# EAGLE design cc2652_zr_Type-A (EAGLE 9.6.2)
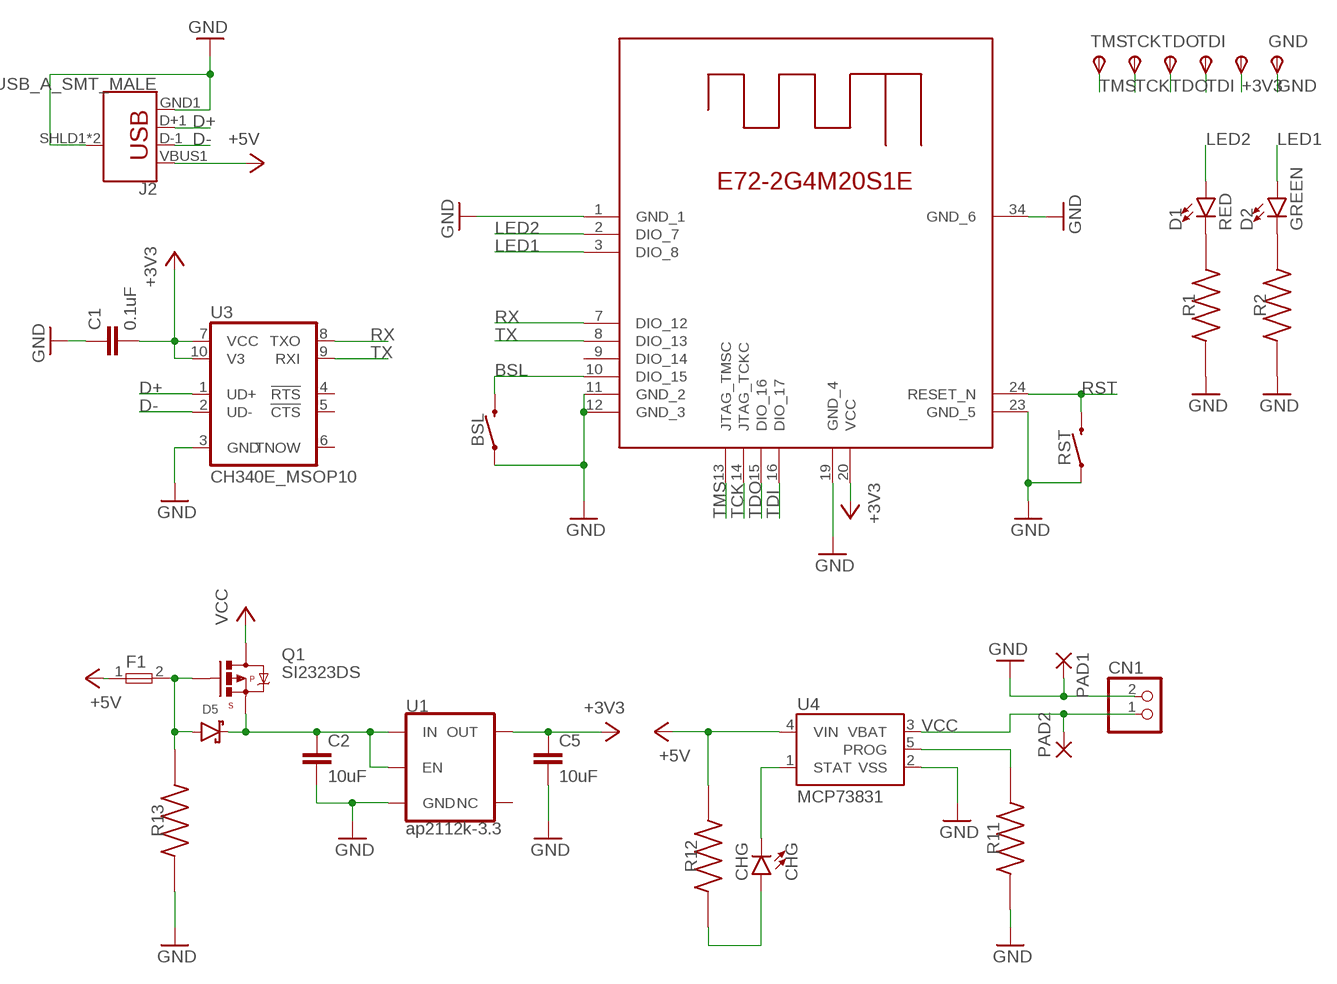
[diagram p0: schematic, sheet 1]

## Parts
+3V3  TPSTP11R  [TP11R]
BSL  MOMENTARY-SWITCH-SPST-SMD-4.6X2.8MM  [TACTILE_SWITCH_SMD_4.6X2.8MM]
C1  0.1uF  0.1UF-0603-25V-(+80/-20%)  [0603]
C2  10uF  10UF-0603-6.3V-20%  [0603]
C5  10uF  10UF-0603-6.3V-20%  [0603]
CHG  CHG  LED-BLUE0603  [LED-0603]
CN1  JST_2PIN-SMT-RA  [JST-PH-2-SMT-RA]
D1  RED  LED-RED0603  [LED-0603]
D2  GREEN  LED-GREEN0603  [LED-0603]
D5  DIODE-SCHOTTKY  [SOD-323]
F1  FEMTOSMDC016F-02  [RESC1608X50N]
GND  TPSTP11R  [TP11R]
J2  USB_A_SMT_MALE  [USB-A-SMT-MALE]
PAD1  WIREPADSMD1,27-254  [SMD1,27-2,54]
PAD2  WIREPADSMD1,27-254  [SMD1,27-2,54]
Q1  SI2323DS  MOSFET-PCHANNEL  [SOT23]
R1  2.2k  RC0402FR-073M6L  [RESC1005X40N]
R2  2.2k  RC0402FR-073M6L  [RESC1005X40N]
R11  2k  RC0402FR-073M6L  [RESC1005X40N]
R12  2.2k  RC0402FR-073M6L  [RESC1005X40N]
R13  10k  RC0402FR-073M6L  [RESC1005X40N]
RST  MOMENTARY-SWITCH-SPST-SMD-4.6X2.8MM  [TACTILE_SWITCH_SMD_4.6X2.8MM]
TCK  TPSTP11R  [TP11R]
TDI  TPSTP11R  [TP11R]
TDO  TPSTP11R  [TP11R]
TMS  TPSTP11R  [TP11R]
U1  ap2112k-3.3  V_REG_AP2112K-3.3V  [SOT23-5]
U3  CH340E_MSOP10  [MSOP10]
U4  MCP73831  [SOT23-5]
U$1  E72-2G4M20S1E  [E72-2G4M20S1E]

## Nets
+3V3: +3V3.TP(PP) C1.2 C5.1 U1.5(OUT) U3.7(VCC) U3.10(V3) U$1.20(VCC)
+5V: F1.1 J2.VBUS1(VBUS) R12.2 U4.4(VIN)
BSL: BSL.3 BSL.4 U$1.10(DIO_15)
D+: J2.D+1(D+) U3.1(UD+)
D-: J2.D-1(D-) U3.2(UD-)
GND: BSL.1 BSL.2 C1.1 C2.2 C5.2 CN1.2 GND.TP(PP) J2.GND1(GND) J2.SHLD1(SHIELD) J2.SHLD2(SHIELD) PAD1.1(P) R1.1 R2.1 R11.1 R13.1 RST.1 RST.2 U1.2(GND) U3.3(GND) U4.2(VSS) U$1.1(GND_1) U$1.11(GND_2) U$1.12(GND_3) U$1.19(GND_4) U$1.23(GND_5) U$1.34(GND_6)
LED1: D2.A U$1.3(DIO_8)
LED2: D1.A U$1.2(DIO_7)
N$1: C2.1 D5.C Q1.2(S) U1.1(IN) U1.3(EN)
N$2: D5.A F1.2 Q1.1(G) R13.2
N$3: D1.C R1.2
N$4: D2.C R2.2
N$8: R11.2 U4.5(PROG)
N$9: CHG.A R12.1
N$11: CHG.C U4.1(STAT)
RST: RST.3 RST.4 U$1.24(RESET_N)
RX: U3.8(TXO) U$1.7(DIO_12)
TCK: TCK.TP(PP) U$1.14(JTAG_TCKC)
TDI: TDI.TP(PP) U$1.16(DIO_17)
TDO: TDO.TP(PP) U$1.15(DIO_16)
TMS: TMS.TP(PP) U$1.13(JTAG_TMSC)
TX: U3.9(RXI) U$1.8(DIO_13)
VCC: CN1.1 PAD2.1(P) Q1.3(D) U4.3(VBAT)
Unconnected: U1.4(NC) U3.4(!RTS) U3.5(!CTS) U3.6(TNOW) U$1.9(DIO_14)

## Library data of the parts
+3V3 GND TCK TDI TDO TMS = testpad:TPS: TEST PIN
BSL RST = SparkFun-Switches:MOMENTARY-SWITCH-SPST: Momentary Switch (Pushbutton) - SPST Normally-open (NO) SPST momentary switches (buttons, pushbuttons). Variants PTH-12MM - 12mm square, through-hole Momentary Pushbutton Switch - 12mm Square <https://www.sparkfun.com/products/9190> (COM-09190) PTH-6.0MM, PTH-6.0MM-KIT - 6.0mm square, through-hole Mini Pushbutton Switch <https://www.sparkfun.com/products/97> (COM-00097) KIT package intended for soldering kit's - only one side of pads' copper is exposed. PTH-RIGHT-ANGLE-KIT - Right-angle, through-hole Right Angle Tactile Button <https://www.sparkfun.com/products/10791> - Used on SparkFun BigTime Watch Kit <https://www.sparkfun.com/products/11734> SMD-12MM - 12mm square, surface-mount Tactile Button - SMD (12mm) <https://www.sparkfun.com/products/12993> (COM-12993) Used on SparkFun PicoBoard <https://www.sparkfun.com/products/11888> SMD-4.5MM - 4.5mm Square Trackball Switch Used on SparkFun Blackberry Trackballer Breakout <https://www.sparkfun.com/products/13169> SMD-4.6MMX2.8MM - 4.60mm x 2.80mm, surface mount Used on SparkFun SAMD21 Mini Breakout <https://www.sparkfun.com/products/13664> SMD-5.2MM, SMD-5.2-REDUNDANT - 5.2mm square, surface-mount Mini Pushbutton Switch - SMD <https://www.sparkfun.com/products/8720> (COM-08720) Used on Arduino Pro Mini <https://www.sparkfun.com/products/11114> REDUNDANT package connects both switch circuits together SMD-6.0X3.5MM - 6.0 x 3.5mm, surface mount Momentary Reset Switch SMD <https://www.sparkfun.com/products/8229> (COM-08229) SMD-6.2MM-TALL - 6.2mm square, surface mount Tactile Button - SMD (6mm) <https://www.sparkfun.com/products/12992> Used on SparkFun Digital Sandbox <https://www.sparkfun.com/products/12651> SMD-RIGHT-ANGLE - Right-angle, surface mount Used on SparkFun Block for Intel® Edison - Arduino <https://www.sparkfun.com/products/13036>; PROD_ID: SWCH-13065
C1 = SparkFun-Capacitors:0.1UF: 0.1µF ceramic capacitors A capacitor is a passive two-terminal electrical component used to store electrical energy temporarily in an electric field.; PROD_ID: CAP-00810
C2 C5 = SparkFun-Capacitors:10UF: 10.0µF ceramic capacitors A capacitor is a passive two-terminal electrical component used to store electrical energy temporarily in an electric field.; PROD_ID: CAP-11015
CHG = SparkFun-LED:LED-BLUE: Blue SMD LED Used in manufacturing of various products at SparkFun Packages: 0603 - SMD 0603 package [Product Link] <http://www.digikey.com/product-detail/en/SMLE12BC7TT86/511-1589-2-ND/1641808> 1206 - SMD1206 package [Product Link] <http://www.digikey.com/product-detail/en/lite-on-inc/LTST-C150TBKT/160-1643-1-ND/573584> SparkFun Products: ESP8266 Thing-Dev Board <https://www.sparkfun.com/products/13711> RedBoard <https://www.sparkfun.com/products/12757>; PROD_ID: DIO-08575; VALUE: BLUE
CN1 = adafruit:JST_2PIN: JST 2-Pin Connectors of various flavors SMT-RA (S2B-PH-SM4) 4UConnector #17311 SMT (B2B-PH-SM4) THM-RA (S2B-PH) THM (B2B-PH)
D1 = SparkFun-LED:LED-RED: Red SMD LED Used in manufacturing of most products at SparkFun Packages: 0603 - SMD 0603 package [Product Link] <http://docs.avagotech.com/docs/AV02-0551EN> 0603 SMART - SMD 0603 SMART package ( more efficient and expensive)[Product Link] <http://www.osram-os.com/Graphics/XPic2/00077099_0.pdf> 1206 - SMD1206 package [Product Link] <https://www.sparkfun.com/datasheets/DevTools/LilyPad/Q150OVS4.pdff> SparkFun Products: Pro Mini 328 -5V <https://www.sparkfun.com/products/821> RedBoard <https://www.sparkfun.com/products/12757> IOIO-OTG <https://www.sparkfun.com/products/13613>; PROD_ID: DIO-00819
D2 = SparkFun-LED:LED-GREEN: Green SMD LED Used in manufacturing of various products at SparkFun Packages: 0603 - SMD 0603 package [Product Link] <http://www.futureelectronics.com/en/technologies/semiconductors/optoelectronics/leds/Pages/9894312-LTST-C190GKT.aspx?CrossPart=HSMG-C190&IM=0> LilyPad 1206 - SMD1206 LilyPad package [Product Link] <http://www.futureelectronics.com/en/Technologies/Product.aspx?ProductID=IN150NGHARVATEKCORPORATION2049943&IM=0> 1206 - SMD1206 package [Product Link] <http://www.futureelectronics.com/en/technologies/semiconductors/optoelectronics/leds/Pages/8315665-LTST-C150KGKT.aspx?IM=0> 1206 Bottom Mount -SMD 1206 Bottom Mount [Product Link] <http://www.digikey.com/product-detail/en/lite-on-inc/LTST-C230KGKT/160-1456-1-ND/386854> SparkFun Products: Pro Mini 328 -5V <https://www.sparkfun.com/products/821> RedBoard <https://www.sparkfun.com/products/12757> MP3 Trigger <https://www.sparkfun.com/products/13720> Makey Makey <https://www.sparkfun.com/products/11076>; PROD_ID: DIO-00821
D5 = pimoroni-passives:DIODE-SCHOTTKY
F1 = fuse_FEMTOSMDC016F-02:FEMTOSMDC016F-02: PTC Resettable Fuse 0.16A(hold) 0.4A(trip) 9VDC 40A 0.5W 0.1s 1Ohm SMD Solder Pad 0603 T/R Check availability <https://pricing.snapeda.com/parts/FEMTOSMDC016F-02/Littelfuse%20Inc./view-part?ref=eda>; AVAILABILITY: In Stock; DESCRIPTION: Polymeric PTC Resettable Fuse 9V 160 mA Ih Surface Mount 0603 (1608 Metric), Concave; MF: Littelfuse Inc.; MP: FEMTOSMDC016F-02; PACKAGE: None; PRICE: None; PURCHASE-URL: https://pricing.snapeda.com/search/part/FEMTOSMDC016F-02/?ref=eda
J2 = SparkFun-Connectors:USB_A: USB-A Connector Male and female variants, as well as PTH and SMT variants SparkFun Products: SparkFun XBee Explorer Dongle <https://www.sparkfun.com/products/11697> PTH Male SparkFun MicroView-USB Programmer <https://www.sparkfun.com/products/12924> SMT Male SparkFun USB Type A Female Breakout <https://www.sparkfun.com/products/12700> SMT Female; PROD_ID: CONN-11499
PAD1 PAD2 = wirepad:WIREPAD: Wire PAD connect wire on PCB
Q1 = pimoroni-passives:MOSFET-PCHANNEL: Generic PMOSFET
R1 R2 R11-R13 = RC0402FR-073M6L:RC0402FR-073M6L: RESISTOR, 0402 0.063W 1% 3M6; Resistance:3.6Mohm; Resistance Tolerance:± 1%; Power Rating:0.063W; Voltage Rating:50V; Series:RC32H; Temperature Coefficient:± 100ppm/°C; Resistor Element Type:Thick Film; Resistor Case Style:0402; No. of Pins:2; SVHC:No SVHC; Case Style:0402; External Length / Height:1mm; Temperature Coeff. +:100ppm/°C; Temperature Coeff. -:100ppm/°C; External Depth:0.35mm; External Width:0.5mm; Operating Temperature Range:-55°C to +155°C; Overload Voltage:100V Check prices <https://pricing.snapeda.com/parts/RC0402FR-073M6L/Yageo/view-part?ref=eda>; AVAILABILITY: Good; DESCRIPTION: RESISTOR, 0402 0.063W 1% 3M6; Resistance:3.6Mohm; Resistance Tolerance:± 1%; Power Rating:0.063W; Voltage Rating:50V; Series:RC32H; Temperature Coefficient:± 100ppm/°C; Resistor Element Type:Thick Film; Resistor Case Style:0402; No. of Pins:2; SVHC:No SVHC; Case Style:0402; External Length / Height:1mm; Temperature Coeff. +:100ppm/°C; Temperature Coeff. -:100ppm/°C; External Depth:0.35mm; External Width:0.5mm; Operating Temperature Range:-55°C to +155°C; Overload Voltage:100V; MF: Yageo; MP: RC0402FR-073M6L; PACKAGE: 1005 Panasonic Electronic Components; PRICE: None; PURCHASE-URL: https://pricing.snapeda.com/search/part/RC0402FR-073M6L/?ref=eda
U1 = SparkFun-IC-Power:V_REG_AP2112: AP2112 - 600mA CMOS LDO Regulator w/ Enable The AP2112 is CMOS process low dropout linear regulator with enable function, the regulator delivers a guaranteed 600mA (min.) continuous load current. Features Output Voltage Accuracy: ±1.5% Output Current: 600mA (Min.) Foldback Short Current Protection: 50mA Enable Function to Turn ON/OFF VOUT Low Dropout Voltage (3.3V): 250mV (Typ.) @IOUT=600mA Excellent Load Regulation: 0.2%/A (Typ.) Excellent Line Regulation: 0.02%/V (Typ.) Low Quiescent Current: 55μA (Typ.) Low Standby Current: 0.01μA (Typ.) Low Output Noise: 50μVRMS PSRR: 100Hz -65dB, 1kHz -65dB OTSD Protection Stable with 1.0μF Flexible Cap: Ceramic, Tantalum and Aluminum Electrolytic Operation Temperature Range: -40°C to 85°C ESD: MM 400V, HBM 4000V; PROD_ID: VREG-12457; VALUE: 3.3V
U3 = CH340E:CH340E: Check prices <https://pricing.snapeda.com/parts/CH340E/WCH/view-part?ref=eda>; AVAILABILITY: Not in stock; DESCRIPTION: USB to serial chip CH340; MF: WCH; MP: CH340E; PACKAGE: Package; PRICE: None
U4 = SparkFun-IC-Power:MCP73831: MCP73831T Li-Ion, Li-Pol Controller Miniature single cell, fully integrated Li-Ion, Li-polymer charge management controller Datasheet <http://ww1.microchip.com/downloads/en/DeviceDoc/20001984g.pdf> SparkFun Products: SparkFun ESP32 Thing <https://www.sparkfun.com/products/13907> SparkFun 9DoF Razor IMU M0 <https://www.sparkfun.com/products/14001>; PROD_ID: IC-09995
U$1 = E72-2G4M20S1E_M:E72-2G4M20S1E

## Board
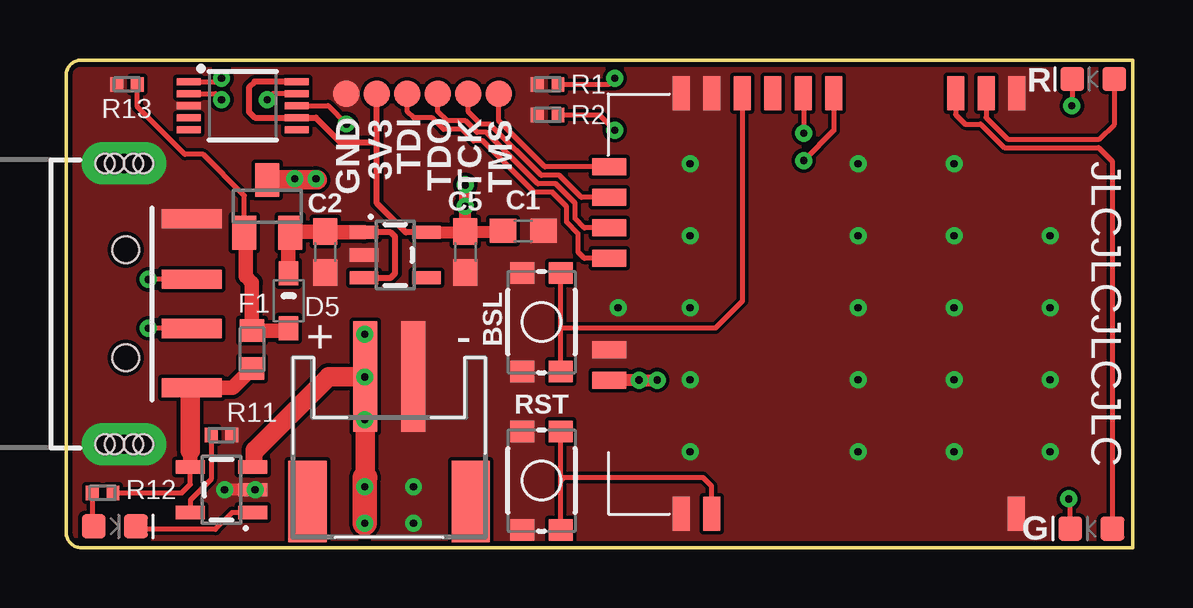
[diagram p1: board, top side]
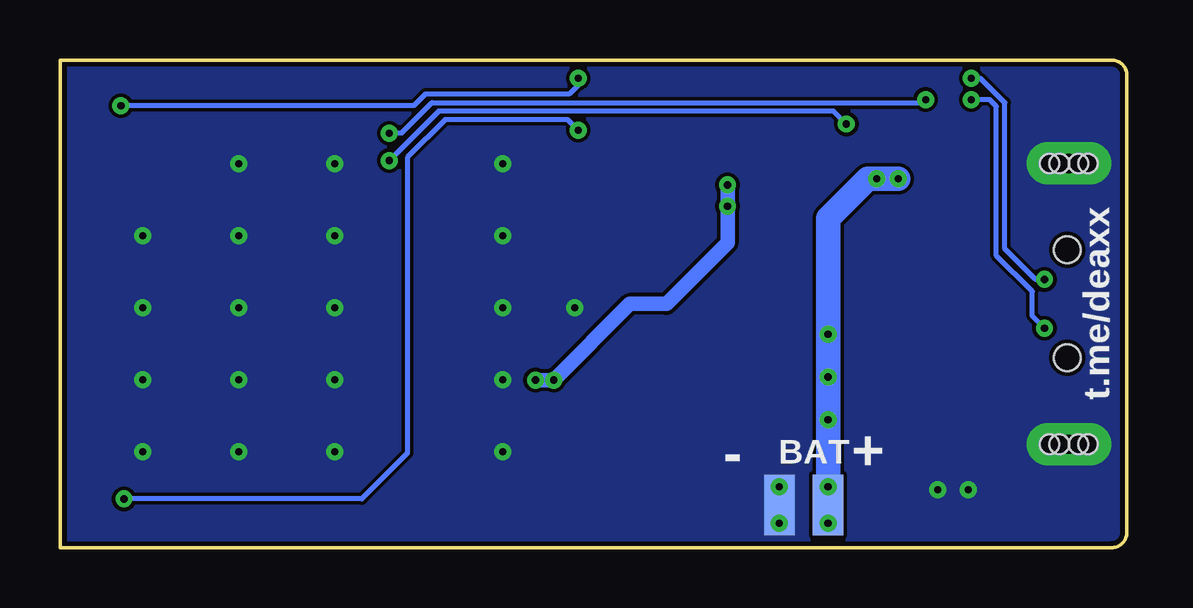
[diagram p2: board, bottom side, seen from below]

Size 44.45 x 20.32 mm. Coordinates in mm from the lower left corner, seen from the top.
Outline: 44.45,0 0.64,0 arc-90 0,0.64 0,19.68 arc-90 0.64,20.32 44.45,20.32 44.45,0
Copper layers (1*16): Top 0.035mm / dielectric 1.5mm / Bottom 0.035mm
Design rules "default *": minimum track width 6mil, minimum drill 0.3mm, track to track 6mil, track to pad 6mil, pad to pad 6mil, via to via 6mil, smd to smd 6mil, copper to edge 0.2mm, drill to drill 0.3mm, minimum pad ring 10mil, minimum via ring 8mil, stop-mask expansion 3mil, vias tented up to drill 0.3mm, thermal gap 10mil

### Footprints (pad centres in the part's own frame; a part is rotated, then mirrored left to right if it is on the bottom)
TP11R = smd 1.1 x 1.1: TP 0,0
TACTILE_SWITCH_SMD_4.6X2.8MM = smd 0.9 x 1: 1 -2.05,-0.8; 2 2.05,-0.8; 3 2.05,0.8; 4 -2.05,0.8
0603 = smd 1.1 x 1: 1 -0.85,0; 2 0.85,0
LED-0603 = smd 1 x 1: A -0.877,0; C 0.877,0
JST-PH-2-SMT-RA = smd 1 x 4.6: 1 1,-3.7; 2 -1,-3.7 | smd 1.6 x 3.4: NC1 -3.4,1.5; NC2 3.4,1.5
SOD-323 = smd 1 x 0.8: A 1.15,0; C -1.15,0
RESC1608X50N = smd 0.94 x 1.02: 1 -0.79,0; 2 0.79,0
USB-A-SMT-MALE = smd 2.5 x 0.8: D+1 10.95,1.027; D-1 10.95,-1.027; GND1 10.95,3.551; VBUS1 10.95,-3.5 | drill 0.8 pad 1.778 long: SHLD1 8.13,-5.85; SHLD2 8.13,5.85 | hole 1.1: 8.2,2.25; 8.2,-2.25 | hole 0.8: 8.53,-5.85; 8.93,-5.85; 7.73,-5.85; 7.33,-5.85; 8.53,5.85; 8.93,5.85; 7.73,5.85; 7.33,5.85
SMD1,27-2,54 = smd 1.27 x 2.54: 1 0,0
SOT23 = smd 1 x 1.4: 1 -0.95,-1.1; 2 0.95,-1.1; 3 0,1.1
RESC1005X40N = smd 0.54 x 0.6: 1 -0.432,0; 2 0.432,0
SOT23-5 = smd 0.55 x 1.2: 1 -0.95,-1.3; 2 0,-1.3; 3 0.95,-1.3; 4 0.95,1.3; 5 -0.95,1.3
MSOP10 = smd 1 x 0.3: 1 -2.25,1; 2 -2.25,0.5; 3 -2.25,0; 4 -2.25,-0.5; 5 -2.25,-1; 6 2.25,-1; 7 2.25,-0.5; 8 2.25,0; 9 2.25,0.5; 10 2.25,1
E72-2G4M20S1E = smd 0.711 x 1.422: 1 17.098,17.538; 2 15.828,17.538; 3 14.558,17.538; 7 9.478,17.538; 8 8.208,17.538; 9 6.938,17.538; 10 5.668,17.538; 11 4.398,17.538; 12 3.128,17.538; 23 3.115,0.016; 24 4.385,0.016; 34 17.085,0.016 | smd 1.422 x 0.711: 13 0.119,14.471; 14 0.119,13.201; 15 0.119,11.931; 16 0.119,10.661; 19 0.119,6.851; 20 0.119,5.581

### Placement (x,y rotation side)
+3V3  12.95,18.92 270 top
BSL  19.81,9.4 270 top
C1  19.05,13.21 180 top
C2  10.79,12.32 270 top
C5  16.64,12.32 270 top
CHG  2.03,0.89 0 top
CN1  13.46,3.43 180 top
D1  42.8,19.53 180 top
D2  42.72,0.79 180 top
D5  9.27,10.29 270 top
F1  7.75,8.26 90 top
GND  11.68,18.92 270 top
J2  -5.71,10.16 0 top
PAD1  14.48,1.78 0 bottom
PAD2  12.45,1.78 0 bottom
Q1  8.38,14.22 0 top
R1  20.07,19.3 0 top
R2  20.07,18.03 0 top
R11  6.48,4.7 180 top
R12  1.52,2.29 0 top
R13  2.54,19.3 0 top
RST  19.81,2.79 270 top
TCK  16.76,18.92 270 top
TDI  14.22,18.92 270 top
TDO  15.49,18.92 270 top
TMS  18.03,18.92 270 top
U1  13.72,12.19 270 top
U3  7.37,18.41 0 top
U4  6.48,2.41 90 top
U$1  22.51,1.4 0 top

### Tracks (layer width: path | path; a pad name or v marks a point on that pad's centre or on a via)
+3V3  (via drill 0.3)
  Top 0.254: U3.10 7.86,19.41 7.62,19.18 7.62,18.16 7.87,17.91 U3.7 10.41,17.91 11.43,16.89 12.95,16.89 | 12.95,16.89 +3V3.TP | U1.5 14.16,13.14 12.95,14.35 12.95,16.89
  Top 0.508: U1.5 16.61,13.14 C5.1 | C5.1 18.16,13.17 C1.2 | 23.88,6.98 U$1.20 | v24.64,6.99 24.63,6.98 23.88,6.98 | v23.88,6.99 23.88,6.98 | C5.1 v16.64,15.11 v16.64,14.22
  Bottom 0.61: v16.64,15.11 16.64,12.7 19.18,10.16 20.7,10.16 v23.88,6.99 v24.64,6.99
+5V
  Top 0.2: R12.2 4.83,2.29 5.18,2.64 U4.4
  Top 0.61: 5.21,4.06 5.18,4.03 U4.4 | J2.VBUS1 6.94,6.66 F1.1
  Top 0.813: 5.18,4.03 5.18,6.6 J2.VBUS1
BSL
  Top 0.2: BSL.3 20.61,9.14 | 20.61,9.14 BSL.4 | U$1.10 28.18,10.27 27.05,9.14 20.61,9.14
D+  (via drill 0.3)
  Top 0.2: U3.1 6.33,19.41 v6.48,19.56 | J2.D+1 v3.44,11.19 v3.43,11.18
  Bottom 0.2: v3.43,11.18 3.81,11.18 5.08,12.45 5.08,18.54 6.1,19.56 v6.48,19.56
D-  (via drill 0.3)
  Top 0.2: U3.2 6.23,18.91 v6.48,18.67 | J2.D-1 v3.44,9.13 v3.43,9.14
  Bottom 0.2: v3.43,9.14 3.94,9.65 3.94,10.68 5.43,12.17 5.43,18.39 5.71,18.67 v6.48,18.67
GND  (via drill 0.3)
  Top 0.152: U4.2 v7.87,2.41
  Top 0.508: U4.2 v6.6,2.41
  other vias: 14.48,2.54 14.48,1.02 33,16 33,13 33,10 33,7 33,4 37,16 37,13 37,10 37,7 37,4 41,13 41,10 41,7 41,4 26,13 26,10 26,7 23,10 26,16 26,4
  pour Top (no thermals): -0.56,-0.71 44.61,-0.71 44.61,20.95 -0.56,20.95
  pour Bottom (no thermals): -0.87,-0.56 44.61,-0.56 44.61,21.19 -0.87,21.19
LED1
  Top 0.2: U$1.3 37.07,18.05 37.47,17.65 38.11,17.65 39.1,16.67 43.02,16.67 43.6,16.09 D2.A
LED2
  Top 0.2: U$1.2 38.34,17.92 39.24,17.02 43.05,17.02 43.69,17.65 43.69,19.51 D1.A
N$1
  Top 0.254: U1.3 13.53,11.24 13.72,11.43 13.72,12.95 13.53,13.14 U1.1
  Top 0.61: U1.1 10.82,13.14 C2.1 9.38,13.17 | 9.38,13.17 9.25,13.17 9.25,11.46 D5.C | 9.38,13.17 Q1.2
N$2
  Top 0.2: Q1.1 7.43,14.67 5.71,16.38 4.95,16.38 2.97,18.36 R13.2
  Top 0.61: D5.A 9.18,9.04 F1.2 7.75,11.05 7.49,11.3 7.49,13.06
  Top 0.813: Q1.1 7.49,13.06
N$3  (via drill 0.3)
  Top 0.2: R1.2 22.61,19.3 v22.86,19.56 | D1.C 41.92,18.43 v41.91,18.41
  Bottom 0.2: v22.86,19.56 22.86,19.27 23.24,18.89 29.23,18.89 29.71,18.41 v41.91,18.41
N$4  (via drill 0.3)
  Top 0.2: R2.2 22.23,18.03 v22.86,17.4 | D2.C 41.84,1.97 v41.78,2.03
  Bottom 0.2: v22.86,17.4 23.3,17.84 28.4,17.84 29.97,16.27 29.97,3.94 31.88,2.03 v41.78,2.03
N$8
  Top 0.2: U4.5 5.18,1.98 6.04,2.85 R11.2
N$9
  Top 0.2: R12.1 1.09,0.95 CHG.A
N$11
  Top 0.2: 7.87,1.37 U4.1 6.92,1.46 6.22,0.76 3.04,0.76 CHG.C
RST
  Top 0.2: RST.3 20.61,2.79 | 20.61,2.79 RST.4 | U$1.24 26.9,2.57 26.54,2.92 20.74,2.92 20.61,2.79
RX  (via drill 0.3)
  Top 0.2: U3.8 10.92,18.41 v11.68,17.65 | U$1.7 31.99,17.38 v30.73,16.13
  Bottom 0.2: v11.68,17.65 12.22,18.19 28.67,18.19 v30.73,16.13
TCK
  Top 0.2: U$1.14 21.47,14.6 20.55,15.52 19.8,15.52 17.66,17.65 17.27,17.65 16.76,18.16 TCK.TP
TDI
  Top 0.2: U$1.16 21.6,12.06 21.34,12.32 21.34,13.09 20.86,13.57 20.86,14.21 20.26,14.81 19.51,14.81 17.37,16.95 16.98,16.95 16.5,17.43 15.73,17.43 15.25,17.91 14.48,17.91 14.22,18.16 TDI.TP
TDO
  Top 0.2: U$1.15 21.6,13.33 21.21,13.72 21.21,14.36 20.41,15.16 19.66,15.16 17.52,17.3 17.13,17.3 16.65,17.78 15.88,17.78 15.49,18.16 TDO.TP
TMS
  Top 0.2: U$1.13 19.95,15.87 18.03,17.78 TMS.TP
TX  (via drill 0.3)
  Top 0.2: U$1.8 30.73,18.92 v30.73,17.27 | U3.9 8.63,18.91 v8.38,18.67
  Bottom 0.2: v8.38,18.67 8.51,18.54 28.96,18.54 30.23,17.27 v30.73,17.27
VCC  (via drill 0.3)
  Top 0.2: 12.46,6.73 12.66,6.93 12.53,7.07 12.53,7.3 12.46,7.37 CN1.1 v12.45,7.11 | v12.45,2.54 v12.45,1.02
  Top 0.508: v9.53,15.37 10.29,15.37 10.33,15.32
  Top 0.61: v10.41,15.37 10.46,15.32 | 7.87,4.06 7.78,3.97 U4.3 7.87,3.46 7.87,4.06
  Top 0.813: 7.87,4.06 10.94,7.13 CN1.1 | 12.46,2.92 12.46,6.73 | Q1.3 10.33,15.32 10.46,15.32
  Top 1.016: v12.45,1.02 12.45,2.9 12.46,2.92
  Bottom 0.2: v12.45,8.89 12.45,8.76 | v12.45,5.33 12.45,7.24 | v12.45,7.11 12.64,7.3 12.45,7.49 | PAD2.1 12.45,2
  Bottom 1.016: 12.45,2 12.45,7.24 12.45,7.49 12.45,8.76 12.45,13.72 10.79,15.37 v9.53,15.37

### Text on the board
tNames: R | GND | 3V3 | TDI | TDO | TCK | TMS | JLCJLCJLCJLC | G
bNames: t.me/deaxx | + | BAT | -